# EAGLE schematic analyzer (EAGLE 6.5.0)
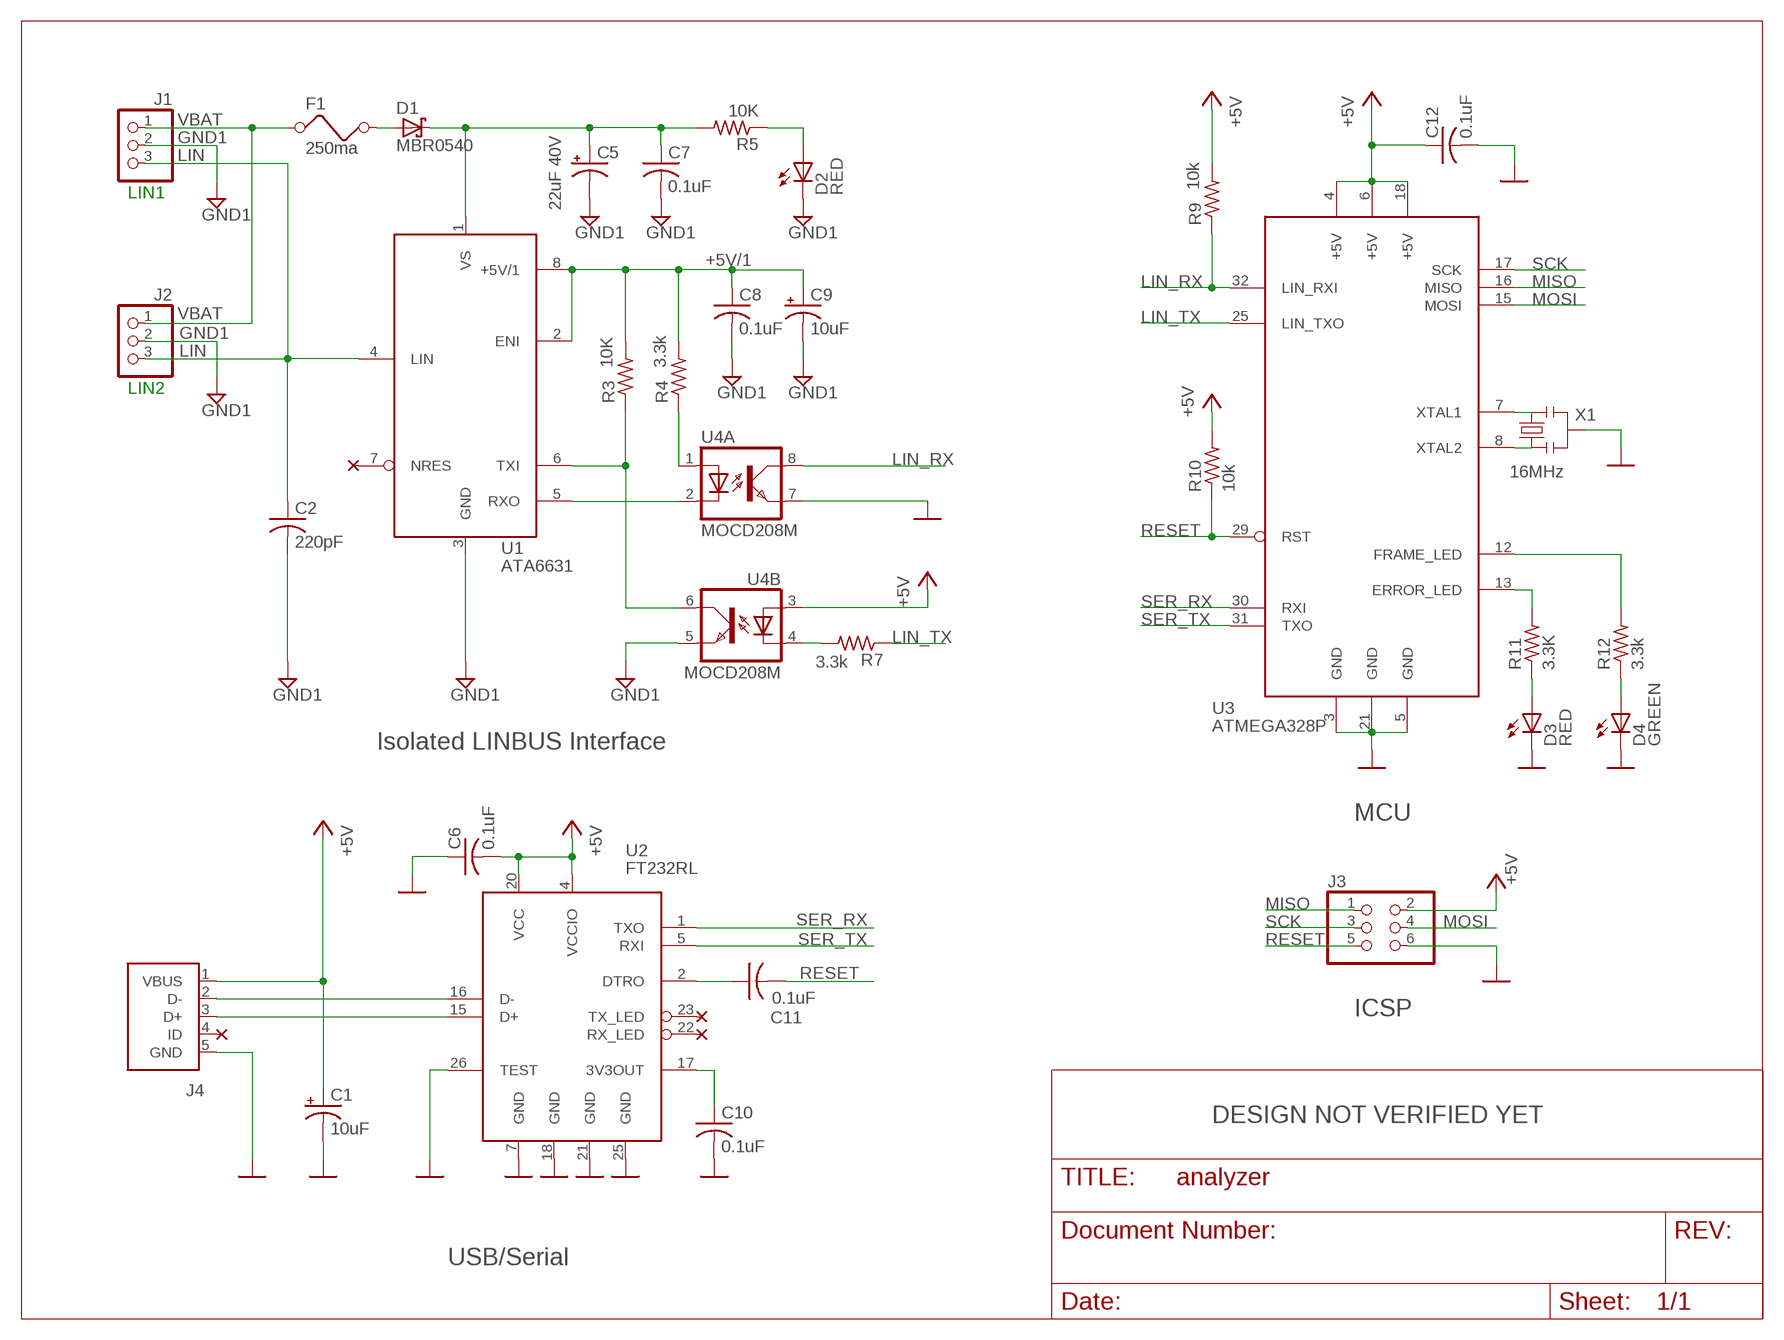
[diagram p0: schematic, sheet 1]

## Parts
C1  10uF  CPOL-USA/3216-18R  [A/3216-18R]
C2  220pF  C-USC0805  [C0805]
C5  22uF 40V  CPOL-USUD-6,3X5,8  [UD-6,3X5,8_NICHICON]
C6  0.1uF  C-USC0805  [C0805]
C7  0.1uF  C-USC0805  [C0805]
C8  0.1uF  C-USC0805  [C0805]
C9  10uF  CPOL-USA/3216-18R  [A/3216-18R]
C10  0.1uF  C-USC0805  [C0805]
C11  0.1uF  C-USC0805  [C0805]
C12  0.1uF  C-USC0805  [C0805]
D1  MBR0540  SMF5.0AT1  [SOD123FL]
D2  RED  LEDSMT1206  [1206]
D3  RED  LEDSMT1206  [1206]
D4  GREEN  LEDSMT1206  [1206]
F1  250ma  FUSE  [1206]
J1  PINHD-1X3  [1X03]
J2  PINHD-1X3  [1X03]
J3  PINHD-2X3  [2X03]
J4  USBSMD  [USB-MINIB]
R3  10K  R-US_R0805  [R0805]
R4  3.3k  R-US_R0805  [R0805]
R5  10K  R-US_R0805  [R0805]
R7  3.3k  R-US_R0805  [R0805]
R9  10k  R-US_R0805  [R0805]
R10  10k  R-US_R0805  [R0805]
R11  3.3K  R-US_R0805  [R0805]
R12  3.3k  R-US_R0805  [R0805]
U1  ATA6631  [SO-08]
U2  FT232RL  [SSOP28DB]
U3  ATMEGA328P  [TQFP32-08]
U4  MOCD208M  [SOIC08-FAIRCHILD]
X1  16MHz  RESONATORSMD  [RESONATOR-SMD]

## Nets
+5V: C1.+ C6.2 C12.1 J3.2 J4.1(VBUS) R9.2 R10.2 U2.4(VCCIO) U2.20(VCC) U3.4(+5V) U3.6(+5V) U3.18(+5V) U4.3(B:A)
+5V/1: C8.1 C9.+ R3.2 R4.2 U1.2(ENI) U1.8(+5V/1)
+12V: C5.+ C7.1 D1.C R5.2 U1.1(VS)
GND: C1.- C6.1 C10.2 C12.2 D3.C D4.C J3.6 J4.5(GND) U2.7(GND) U2.18(GND) U2.21(GND) U2.25(GND) U2.26(TEST) U3.3(GND) U3.5(GND) U3.21(GND) U4.7(A:EMIT) X1.2
GND1: C2.2 C5.- C7.2 C8.2 C9.- D2.C J1.2 J2.2 U1.3(GND) U4.5(B:EMIT)
LIN: C2.1 J1.3 J2.3 U1.4(LIN)
LIN_RX: R9.1 U3.32(LIN_RXI) U4.8(A:COL)
LIN_TX: R7.1 U3.25(LIN_TXO)
MISO: J3.1 U3.16(MISO)
MOSI: J3.4 U3.15(MOSI)
N$1: R4.1 U4.1(A:A)
N$3: D4.A R12.1
N$4: D3.A R11.1
N$5: U1.5(RXO) U4.2(A:C)
N$6: D1.A F1.2
N$7: R11.2 U3.13(ERROR_LED)
N$8: R12.2 U3.12(FRAME_LED)
N$9: R3.1 U1.6(TXI) U4.6(B:COL)
N$10: J4.3(D+) U2.15(D+)
N$11: C11.1 U2.2(DTRO)
N$12: R7.2 U4.4(B:C)
N$13: U3.7(XTAL1) X1.3
N$14: U3.8(XTAL2) X1.1
N$15: J4.2(D-) U2.16(D-)
N$16: C10.1 U2.17(3V3OUT)
N$17: D2.A R5.1
RESET: C11.2 J3.5 R10.1 U3.29(RST)
SCK: J3.3 U3.17(SCK)
SER_RX: U2.1(TXO) U3.30(RXI)
SER_TX: U2.5(RXI) U3.31(TXO)
VBAT: F1.1 J1.1 J2.1
Unconnected: J4.4(ID) U1.7(NRES) U2.22(RX_LED) U2.23(TX_LED)

## Notes on the sheet
- LIN1
- LIN2
- Isolated LINBUS Interface
- MCU
- ICSP
- DESIGN NOT VERIFIED YET
- USB/Serial

## Library data of the parts
C1 C5 C9 = rcl:CPOL-US: POLARIZED CAPACITOR, American symbol
C2 C6-C8 C10-C12 = rcl:C-US: CAPACITOR, American symbol
D1 = diode:SMF5.0AT1: 200 W Transient Voltage Suppressor Source: Data sheet <http://www.onsemi.com/pub_link/Collateral/SMF5.0AT1-D.PDF>
D2-D4 = led:LED: LED OSRAM: - CHIPLED LG R971, LG N971, LY N971, LG Q971, LY Q971, LO R971, LY R971 LH N974, LH R974 LS Q976, LO Q976, LY Q976 LO Q996 - Hyper CHIPLED LW Q18S LB Q993, LB Q99A, LB R99A - SideLED LS A670, LO A670, LY A670, LG A670, LP A670 LB A673, LV A673, LT A673, LW A673 LH A674 LY A675 LS A676, LA A676, LO A676, LY A676, LW A676 LS A679, LY A679, LG A679 - Hyper Micro SIDELED® LS Y876, LA Y876, LO Y876, LY Y876 LT Y87S - SmartLED LW L88C, LW L88S LB L89C, LB L89S, LG L890 LS L89K, LO L89K, LY L89K LS L896, LA L896, LO L896, LY L896 - TOPLED LS T670, LO T670, LY T670, LG T670, LP T670 LSG T670, LSP T670, LSY T670, LOP T670, LYG T670 LG T671, LOG T671, LSG T671 LB T673, LV T673, LT T673, LW T673 LH T674 LS T676, LA T676, LO T676, LY T676, LB T676, LH T676, LSB T676, LW T676 LB T67C, LV T67C, LT T67C, LS T67K, LO T67K, LY T67K, LW E67C LS E67B, LA E67B, LO E67B, LY E67B, LB E67C, LV E67C, LT E67C LW T67C LS T679, LY T679, LG T679 LS T770, LO T770, LY T770, LG T770, LP T770 LB T773, LV T773, LT T773, LW T773 LH T774 LS E675, LA E675, LY E675, LS T675 LS T776, LA T776, LO T776, LY T776, LB T776 LHGB T686 LT T68C, LB T68C - Hyper Mini TOPLED® LB M676 - Mini TOPLED Santana® LG M470 LS M47K, LO M47K, LY M47K Source: http://www.osram.convergy.de LUXEON: - LUMILED® LXK2-PW12-R00, LXK2-PW12-S00, LXK2-PW14-U00, LXK2-PW14-V00 LXK2-PM12-R00, LXK2-PM12-S00, LXK2-PM14-U00 LXK2-PE12-Q00, LXK2-PE12-R00, LXK2-PE12-S00, LXK2-PE14-T00, LXK2-PE14-U00 LXK2-PB12-K00, LXK2-PB12-L00, LXK2-PB12-M00, LXK2-PB14-N00, LXK2-PB14-P00, LXK2-PB14-Q00 LXK2-PR12-L00, LXK2-PR12-M00, LXK2-PR14-Q00, LXK2-PR14-R00 LXK2-PD12-Q00, LXK2-PD12-R00, LXK2-PD12-S00 LXK2-PH12-R00, LXK2-PH12-S00 LXK2-PL12-P00, LXK2-PL12-Q00, LXK2-PL12-R00 Source: www.luxeon.com KINGBRIGHT: KA-3528ASYC Source: www.kingbright.com
F1 = analyzer:FUSE
J1 J2 = pinhead:PINHD-1X3: PIN HEADER
J3 = pinhead:PINHD-2X3: PIN HEADER
J4 = analyzer:USB: USB Connectors USB-B-PTH is fully proven SKU : PRT-00139 USB-miniB is fully proven SKU : PRT-00587 USB-A-PCB is untested. USB-A-H is throughly reviewed, but untested. Spark Fun Electronics SKU : PRT-00437 USB-B-SMT is throughly reviewed, but untested. Needs silkscreen touching up. USB-A-S has not been used/tested USB-MB-H has not been used/tested
R3-R5 R7 R9-R12 = rcl:R-US_: RESISTOR, American symbol
U1 = analyzer:ATA6631
U2 = analyzer:FT232RL
U3 = analyzer:ATMEGA328P
U4 = optocoupler:MOCD20*M: MOCD207M, MOCD208M Dual Channel Phototransistor Small Outline Surface Mount Optocouplers Source: Data sheet <http://www.fairchildsemi.com/ds/MO%2FMOCD207-M.pdf>; MF: FAIRCHILD SEMICONDUCTOR; MPN: MOCD208M; OC_FARNELL: 1505465; OC_NEWARK: 34C7498
X1 = analyzer:RESONATOR: Resonator Small SMD resonator. This is the itty bitty 10/20MHz resonators with built in caps. CSTCE10M0G55 and CSTCE20M0V53. Footprint has been reviewed closely but hasn't been tested yet.

## Net classes
1 power: width 0.254 mm